# EAGLE design project flashing light (EAGLE 9.6.2)
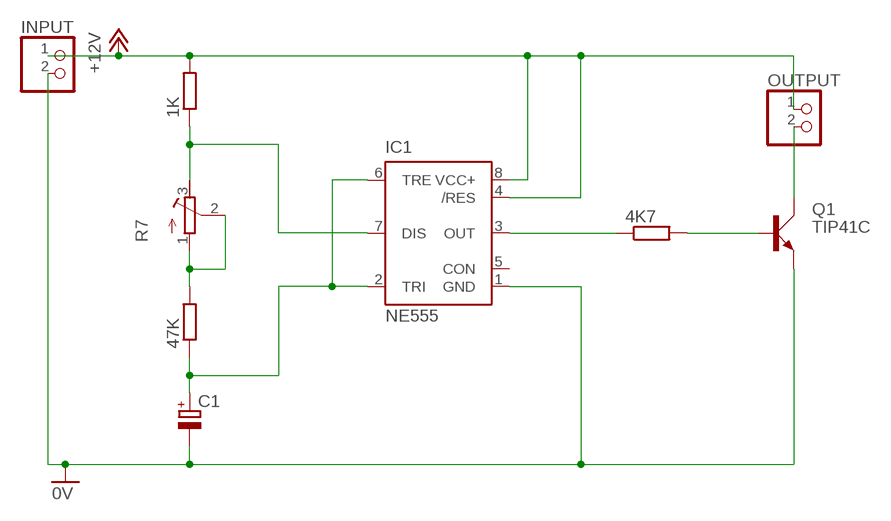
[diagram p0: schematic, sheet 1]

## Parts
1K  R-EU_0207/15  [0207/15]
4K7  R-EU_0207/15  [0207/15]
47K  R-EU_0207/15  [0207/15]
C1  CPOL-EUE2.5-6  [E2,5-6]
IC1  NE555  [DIL-08]
INPUT  PINHD-1X2  [1X02]
OUTPUT  PINHD-1X2  [1X02]
Q1  TIP41C  [TO220AV]
R7  R-TRIMM3339P  [RTRIM3339P]

## Nets
0V: C1.- IC1.1(GND) INPUT.2 Q1.E
+12V: 1K.2 IC1.4(/RES) IC1.8(VCC+) INPUT.1 OUTPUT.1
N$1: 47K.1 C1.+ IC1.2(TRI) IC1.6(TRE)
N$3: OUTPUT.2 Q1.C
N$4: 47K.2 R7.1(A) R7.2(S)
N$5: 1K.1 IC1.7(DIS) R7.3(E)
N$9: 4K7.1 IC1.3(OUT)
N$10: 4K7.2 Q1.B
Unconnected: IC1.5(CON)

## Library data of the parts
1K 4K7 47K = rcl:R-EU_: RESISTOR, European symbol; SPICEPREFIX: R
C1 = rcl:CPOL-EU: POLARIZED CAPACITOR, European symbol; SPICEPREFIX: C
IC1 = st-microelectronics2:NE555: General purpose bipolar Timer; MF: Arrow Electronics; MPN: NE555N; OC_FARNELL: 1467742; OC_NEWARK: 89K1486
INPUT OUTPUT = pinhead:PINHD-1X2: PIN HEADER
Q1 = transistor-power:TIP41C: NPN TRANSISTOR
R7 = rcl2:R-TRIMM: Trimm resistor; SPICEMODEL: X; SPICEPREFIXL: POT

## Board
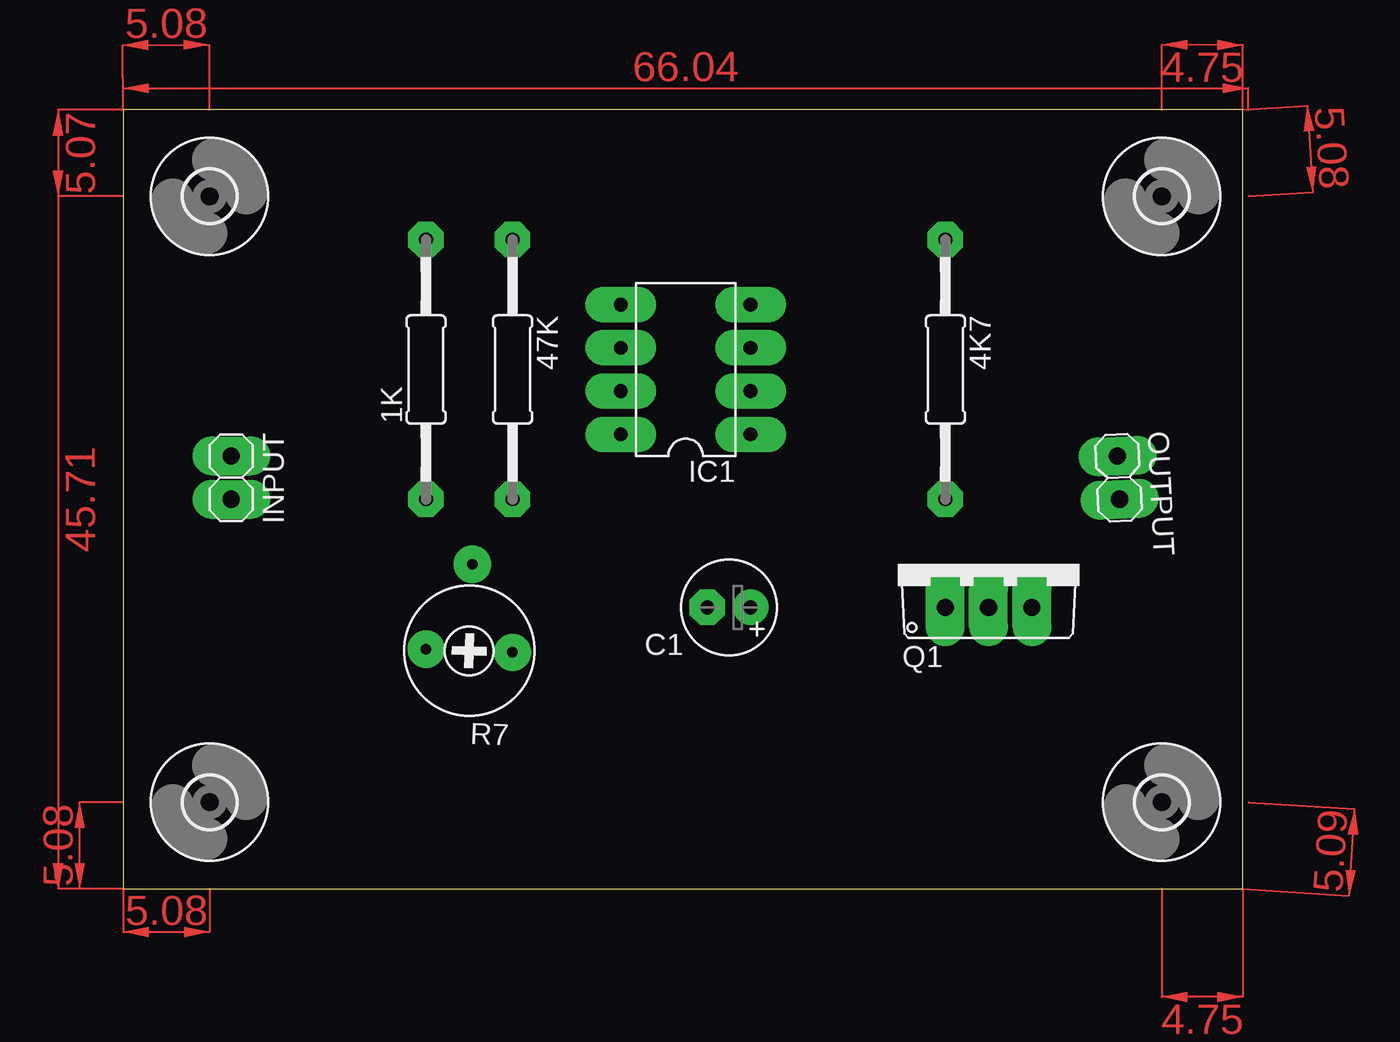
[diagram p1: board, top side]
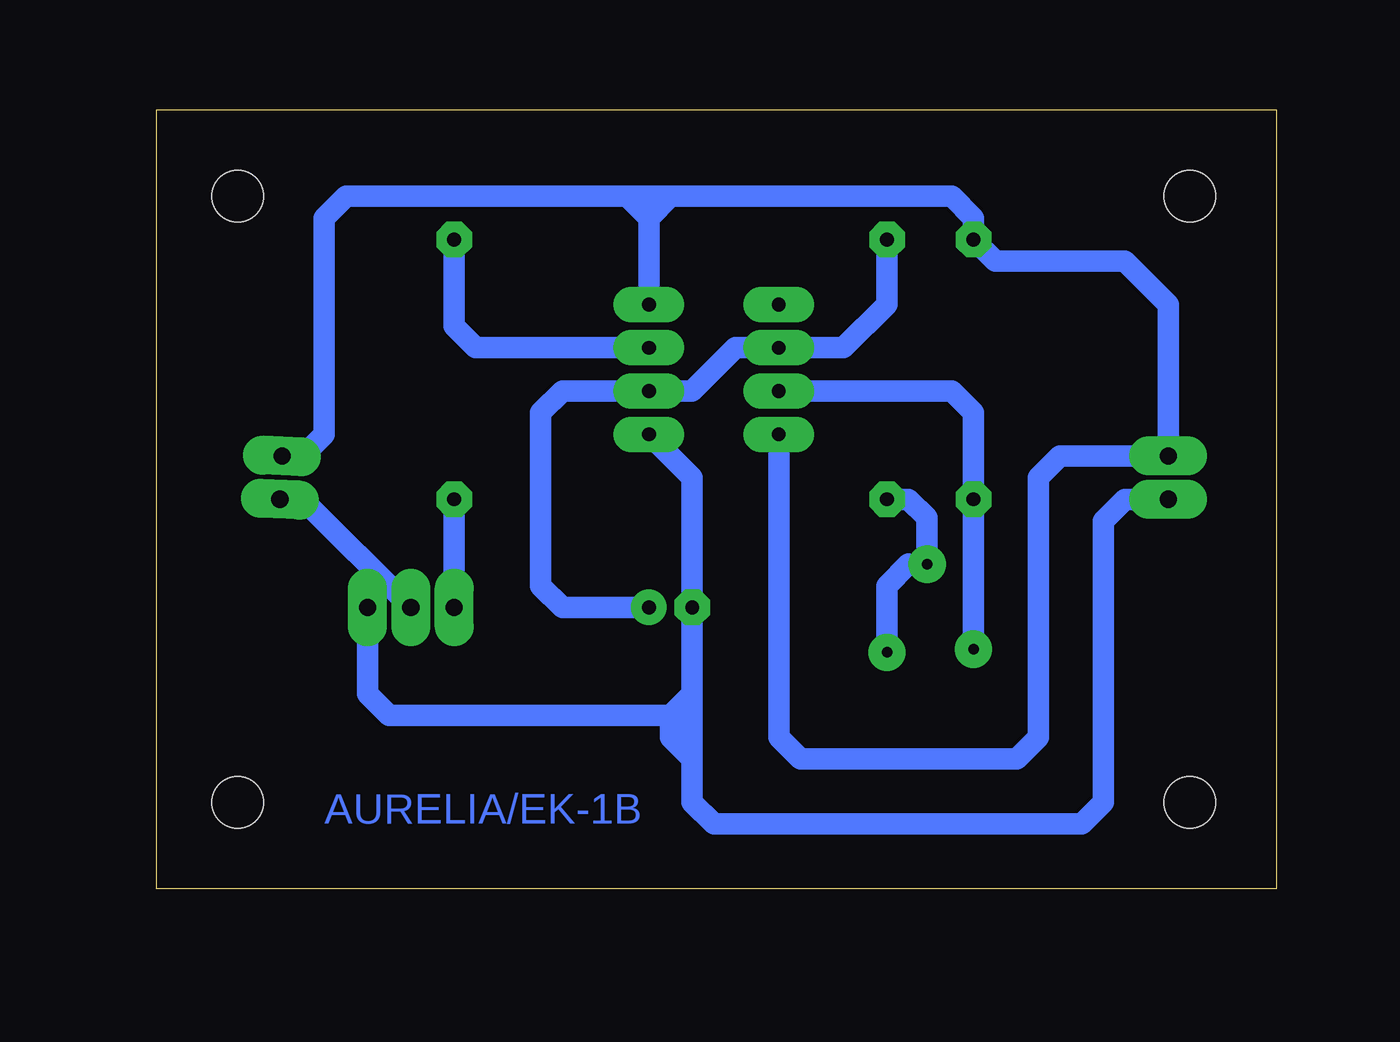
[diagram p2: board, bottom side, seen from below]

Size 65.71 x 45.71 mm. Coordinates in mm from the lower left corner, seen from the top.
Outline: 0,0 65.71,0 65.71,45.71 0,45.71 0,0
Copper layers (1*16): Top 0.035mm / dielectric 1.5mm / Bottom 0.035mm
Design rules "default *": minimum track width 6mil, minimum drill 0.35mm, track to track 6mil, track to pad 6mil, pad to pad 6mil, via to via 6mil, smd to smd 6mil, copper to edge 40mil, drill to drill 6mil, minimum pad ring 25mil, minimum via ring 8mil, stop-mask expansion 4mil, vias tented up to drill 0mil, thermal gap 10mil

### Footprints (pad centres in the part's own frame; a part is rotated, then mirrored left to right if it is on the bottom)
0207/15 = drill 0.813 octagon: 1 -7.62,0; 2 7.62,0
E2,5-6 = drill 0.813 pad 1.6: + -1.27,0 | drill 0.813 pad 1.6 octagon: - 1.27,0
DIL-08 = drill 0.813 pad 1.778 long: 1 -3.81,-3.81; 2 -1.27,-3.81; 3 1.27,-3.81; 4 3.81,-3.81; 5 3.81,3.81; 6 1.27,3.81; 7 -1.27,3.81; 8 -3.81,3.81
1X02 = drill 1.016 long: 1 -1.27,0; 2 1.27,0
TO220AV = drill 1.016 long: B -2.54,-2.54; C 0,-2.54; E 2.54,-2.54
RTRIM3339P = drill 0.61 pad 2.184: 1 -2.54,0; 2 0,-5.08; 3 2.54,0
3,0 = hole 3: 0,0

### Placement (x,y rotation side)
1K  17.78,30.48 90 top
4K7  48.26,30.48 270 top
47K  22.86,30.48 270 top
C1  35.56,16.51 180 top
IC1  33.02,30.48 90 top
INPUT  6.35,24.13 270 top
OUTPUT  58.42,24.13 272.8 top
Q1  50.8,19.05 0 top
R7  20.32,13.97 177.9 top
U$1  [3,0]  60.96,40.64 0 top
U$2  [3,0]  60.96,5.08 0 top
U$3  [3,0]  5.08,5.08 0 top
U$4  [3,0]  5.08,40.64 0 top

### Tracks (layer width: path | path; a pad name or v marks a point on that pad's centre or on a via)
0V
  Bottom 1.27: IC1.1 34.29,24.13 C1.- 34.29,11.43 | 34.29,7.62 34.29,5.08 33.02,3.81 11.43,3.81 10.16,5.08 10.16,21.59 8.89,22.86 INPUT.2 | 34.29,7.62 34.29,10.16 | 34.29,10.16 34.29,11.43 | Q1.E 53.34,11.43 52.07,10.16 35.56,10.16 | 34.29,10.16 35.56,10.16 | 34.29,11.43 35.56,10.16 | 35.56,10.16 35.56,8.89 34.29,7.62
+12V
  Bottom 1.27: 38.1,40.64 36.83,39.37 | 36.83,39.37 IC1.4 | 35.56,40.64 38.1,40.64 | IC1.8 29.21,8.89 27.94,7.62 15.24,7.62 13.97,8.89 13.97,24.13 12.7,25.4 INPUT.1 6.35,34.29 8.89,36.83 16.51,36.83 1K.2 17.78,39.37 19.05,40.64 35.56,40.64 | 35.56,40.64 36.83,39.37 | OUTPUT.1 57.15,25.4 55.88,26.67 55.88,39.37 54.61,40.64 38.1,40.64
N$1
  Bottom 1.27: 27.94,31.75 IC1.6 | IC1.6 31.75,31.75 34.29,29.21 IC1.2 41.91,29.21 43.18,27.94 43.18,17.78 41.91,16.51 C1.+ | IC1.6 25.4,31.75 22.86,34.29 47K.1
N$3
  Bottom 1.27: OUTPUT.2 57.15,22.86 Q1.C
N$4
  Bottom 1.27: 47K.2 21.59,22.86 20.51,21.78 R7.2 21.59,19.05 22.86,17.78 R7.1
N$5
  Bottom 1.27: IC1.7 19.05,29.21 17.78,27.94 1K.1 R7.3
N$9
  Bottom 1.27: IC1.3 46.99,31.75 48.26,33.02 4K7.1
N$10
  Bottom 1.27: 4K7.2 Q1.B
(copper drawn outside any net)
  shapes: Top area x10

### Text on the board
Bottom: AURELIA/EK-1B